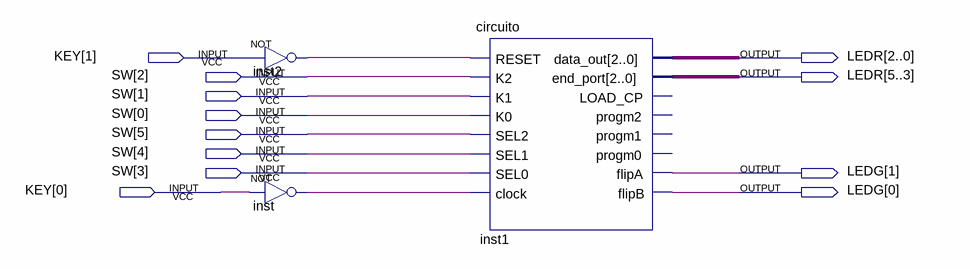
[diagram p0: schematic sheet]
// Quartus schematic circuito_placa.bdf as structural Verilog: 3 symbols, 12 pins
module circuito_placa (
  input  [1:0] KEY,
  input  [5:0] SW,
  output [5:0] LEDR,
  output [1:0] LEDG
);

  wire inst2_out, inst_out;

  not inst2 (inst2_out, KEY[1]);
  not inst (inst_out, KEY[0]);
  circuito inst1 (
    .RESET(inst2_out), .K2(SW[2]), .K1(SW[1]), .K0(SW[0]), .SEL2(SW[5]), .SEL1(SW[4]), .SEL0(SW[3]),
    .clock(inst_out), .data_out(LEDR[2:0]), .end_port(LEDR[5:3]), .flipA(LEDG[1]), .flipB(LEDG[0]));  // open: LOAD_CP, progm2, progm1, progm0
endmodule
